# Altium schematic sheet GR_Split.SchDoc
size A4
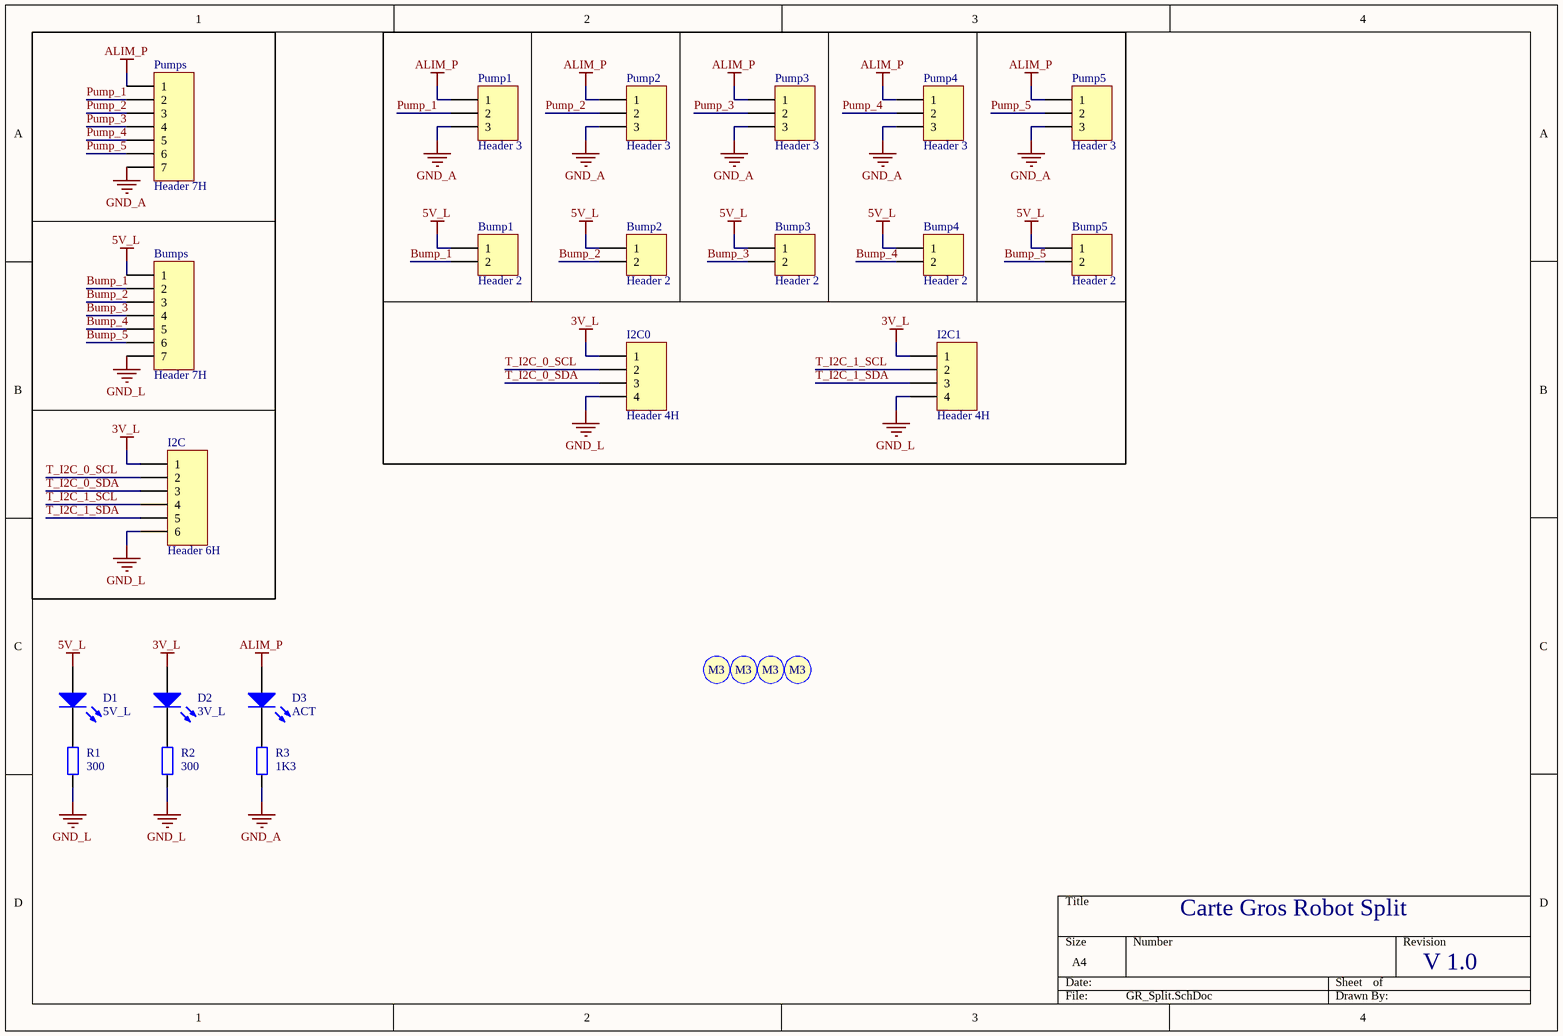
[diagram p0: GR_Split.SchDoc]

## Parts
Bump1  Header 2  [B2B-XH-A]
Bump2  Header 2  [B2B-XH-A]
Bump3  Header 2  [B2B-XH-A]
Bump4  Header 2  [B2B-XH-A]
Bump5  Header 2  [B2B-XH-A]
Bumps  Header 7H  [B7B-XH-A]
D1  5V_L  [KP-3216SEC]
D2  3V_L  [KP-3216SEC]
D3  ACT  [KP-3216SEC]
I2C  Header 6H  [B6B-XH-A]
I2C0  Header 4H  [B4B-XH-A]
I2C1  Header 4H  [B4B-XH-A]
Pump1  Header 3  [B3B-XH-A]
Pump2  Header 3  [B3B-XH-A]
Pump3  Header 3  [B3B-XH-A]
Pump4  Header 3  [B3B-XH-A]
Pump5  Header 3  [B3B-XH-A]
Pumps  Header 7H  [B7B-XH-A]
R1  value 300  [Resistor 1206]  (hidden comment: Res2)
R2  value 300  [Resistor 1206]  (hidden comment: Res2)
R3  value 1K3  [Resistor 1206]  (hidden comment: Res2)
S1  Screw M3  [Screw M3]  (value not drawn)
S2  Screw M3  [Screw M3]  (value not drawn)
S3  Screw M3  [Screw M3]  (value not drawn)
S4  Screw M3  [Screw M3]  (value not drawn)

## Nets
3V_L: D2.1(A) I2C.1 I2C0.1 I2C1.1
5V_L: Bump1.1 Bump2.1 Bump3.1 Bump4.1 Bump5.1 Bumps.1 D1.1(A)
ALIM_P: D3.1(A) Pump1.1 Pump2.1 Pump3.1 Pump4.1 Pump5.1 Pumps.1
GND_A: Pump1.3 Pump2.3 Pump3.3 Pump4.3 Pump5.3 Pumps.7 R3.2
GND_L: Bumps.7 I2C.6 I2C0.4 I2C1.4 R1.1 R2.1
Bump_1: Bump1.2 Bumps.2
Bump_2: Bump2.2 Bumps.3
Bump_3: Bump3.2 Bumps.4
Bump_4: Bump4.2 Bumps.5
Bump_5: Bump5.2 Bumps.6
Pump_1: Pump1.2 Pumps.2
Pump_2: Pump2.2 Pumps.3
Pump_3: Pump3.2 Pumps.4
Pump_4: Pump4.2 Pumps.5
Pump_5: Pump5.2 Pumps.6
T_I2C_0_SCL: I2C.2 I2C0.2
T_I2C_0_SDA: I2C.3 I2C0.3
T_I2C_1_SCL: I2C.4 I2C1.2
T_I2C_1_SDA: I2C.5 I2C1.3
NetD1_2: D1.2(K) R1.2
NetD2_2: D2.2(K) R2.2
NetD3_2: D3.2(K) R3.1

## Notes on the sheet
- Carte Gros Robot Split
- V 1.0
- (in symbol Screw M3) M3

## Library data of the parts
Bump1-Bump5 = Header 2: Header, 2-Pin; LatestRevisionDate: 17-Jul-2002; LatestRevisionNote: Re-released for DXP Platform.; Publisher: Altium Limited
Bumps Pumps = Header 7H: Header, 7-Pin, Right Angle; LatestRevisionDate: 17-Jul-2002; LatestRevisionNote: Re-released for DXP Platform.; Publisher: Altium Limited
D1-D3 = LED2: Typical RED, GREEN, YELLOW, AMBER GaAs LED; Published: 8-Jun-2000; LatestRevisionDate: 17-Jul-2002; LatestRevisionNote: Re-released for DXP Platform.; PackageVersion: Feb-2002; PackageReference: 3.2X1.6X1.1; Publisher: Altium Limited; PackageDescription: SM LED; 2 Flat Leads
I2C = Header 6H: Header, 6-Pin, Right Angle; LatestRevisionDate: 17-Jul-2002; LatestRevisionNote: Re-released for DXP Platform.; Publisher: Altium Limited
I2C0 I2C1 = Header 4H: Header, 4-Pin, Right Angle; LatestRevisionDate: 17-Jul-2002; LatestRevisionNote: Re-released for DXP Platform.; Publisher: Altium Limited
Pump1-Pump5 = Header 3: Header, 3-Pin; LatestRevisionDate: 17-Jul-2002; LatestRevisionNote: Re-released for DXP Platform.; Publisher: Altium Limited
R1-R3 = Res2: Resistor; Published: 8-Jun-2000; LatestRevisionDate: 17-Jul-2002; LatestRevisionNote: Re-released for DXP Platform.; PackageReference: AXIAL-0.4; Publisher: Altium Limited; PackageDescription: Axial Device, Thru-Hole; 2 Leads; 0.4 in Pin Spacing